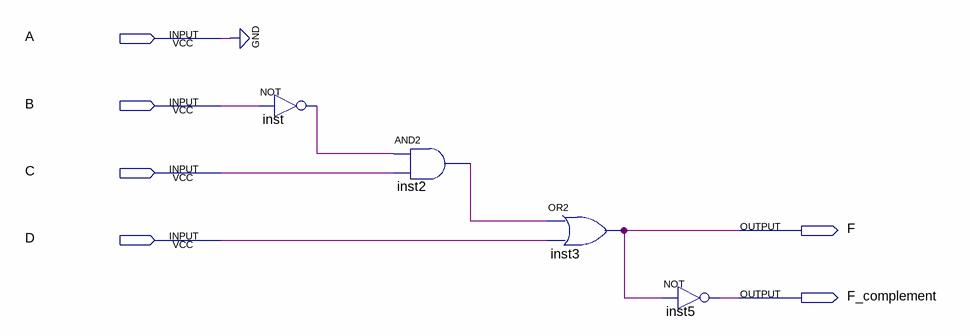
[diagram p0: schematic sheet]
// Quartus schematic step_1.bdf as structural Verilog: 4 symbols, 6 pins
module step_1 (
  input  A,
  input  B,
  input  C,
  input  D,
  output F,
  output F_complement
);

  wire inst2_out, inst_out;

  not inst (inst_out, B);
  and inst2 (inst2_out, inst_out, C);
  or inst3 (F, inst2_out, D);
  not inst5 (F_complement, F);
  // also tied to GND on the sheet: A
endmodule
